# Altium schematic sheet Sheet1.SchDoc
size OrCAD A
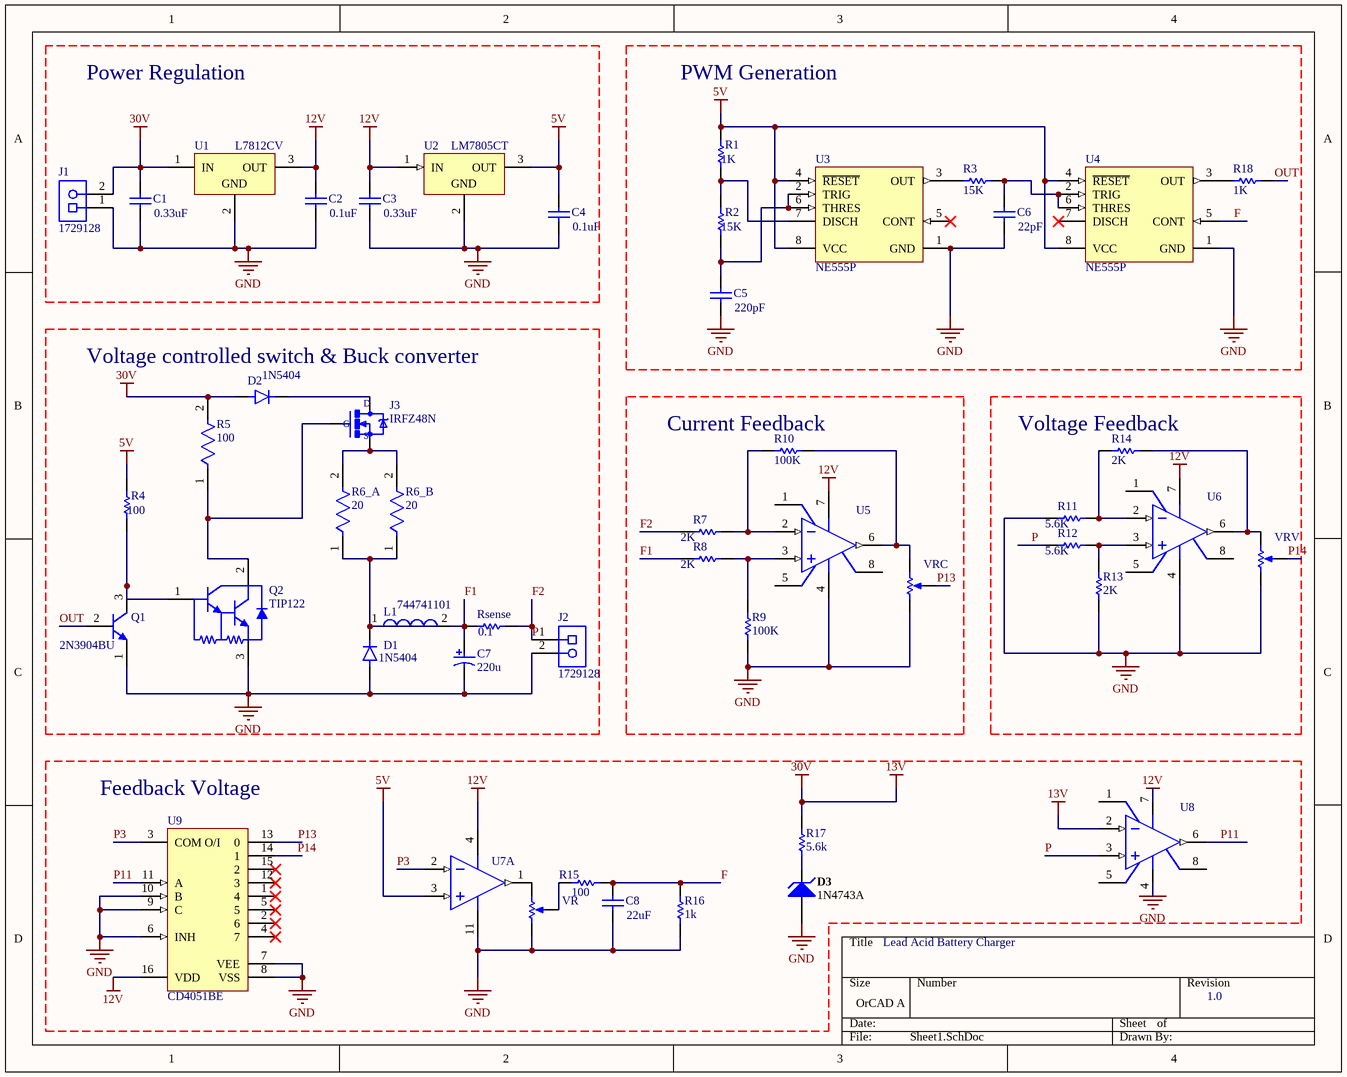
[diagram p0: Sheet1.SchDoc]

## Parts
C1  value 0.33uF  [RAD-0.3]  (hidden comment: Cap)
C2  value 0.1uF  [RAD-0.3]  (hidden comment: Cap)
C3  value 0.33uF  [RAD-0.3]  (hidden comment: Cap)
C4  value 0.1uF  [RAD-0.3]  (hidden comment: Cap)
C5  value 220pF  [RAD-0.3]  (hidden comment: Cap)
C6  value 22pF  [RAD-0.3]  (hidden comment: Cap)
C7  220u  [PNSC-ECA-1VM221-2]
C8  value 22uF  [RAD-0.3]  (hidden comment: Cap)
D1  1N5404  [DIOAD1990W125L900D530]
D2  1N5404  [DIOAD1990W125L900D530]
D3  1N4743A  [FAIR-DO-41-2_V]
J1  1729128  [PHOE-1729128-2_V]
J2  1729128  [PHOE-1729128-2_V]
J3  IRFZ48N  [TO-220]
L1  744741101  [WE-TI-LS]
Q1  2N3904BU  [FAIR-TO-92]
Q2  TIP122  [ONSC-TO-220-3-221A-09]
R1  value 1K  [AXIAL-0.3]  (hidden comment: Res1)
R2  value 15K  [AXIAL-0.3]  (hidden comment: Res1)
R3  value 15K  [AXIAL-0.3]  (hidden comment: Res1)
R4  value 100  [AXIAL-0.3]  (hidden comment: Res1)
R5  100  [FP-SQP500-MFG]
R6_A  20  [FP-SQP500-MFG]
R6_B  20  [FP-SQP500-MFG]
R7  value 2K  [AXIAL-0.3]  (hidden comment: Res1)
R8  value 2K  [AXIAL-0.3]  (hidden comment: Res1)
R9  value 100K  [AXIAL-0.3]  (hidden comment: Res1)
R10  value 100K  [AXIAL-0.3]  (hidden comment: Res1)
R11  value 5.6K  [AXIAL-0.3]  (hidden comment: Res1)
R12  value 5.6K  [AXIAL-0.3]  (hidden comment: Res1)
R13  value 2K  [AXIAL-0.3]  (hidden comment: Res1)
R14  value 2K  [AXIAL-0.3]  (hidden comment: Res1)
R15  value 100  [AXIAL-0.3]  (hidden comment: Res1)
R16  value 1k  [AXIAL-0.3]  (hidden comment: Res1)
R17  value 5.6k  [AXIAL-0.3]  (hidden comment: Res1)
R18  value 1K  [AXIAL-0.3]  (hidden comment: Res1)
Rsense  value 0.1  [AXIAL-0.3]  (hidden comment: Res1)
U1  L7812CV  [TO220]
U2  LM7805CT  [FAIR-TO-220-3]
U3  NE555P  [P0008A]
U4  NE555P  [P0008A]
U5  LM741CN/NOPB  [P0008A]  (value not drawn)
U6  LM741CN/NOPB  [P0008A]  (value not drawn)
U7  TL074ACN  [N0014A]  (value not drawn)  (part A of 4)
U8  LM741CN/NOPB  [P0008A]  (value not drawn)
U9  CD4051BE  [N0016A]
VR  3362P-1-103LF  [BOUR-3362P]  (value not drawn)
VRC  3362P-1-103LF  [BOUR-3362P]  (value not drawn)
VRV  3362P-1-103LF  [BOUR-3362P]  (value not drawn)

## Blocks framed on the sheet
Power Regulation: C1-C4 J1 U1 U2
PWM Generation: C5 C6 R1-R3 R18 U3 U4
Voltage controlled switch & Buck converter: C7 D1 D2 J2 J3 L1 Q1 Q2 R4 R5 R6_A R6_B Rsense
Current Feedback: R7-R10 U5 VRC
Voltage Feedback: R11-R14 U6 VRV
Feedback Voltage: C8 D3 R15-R17 U7-U9 VR

## Nets
5V: C4.2 R1.2 R4.2 U2.3(OUT) U3.4(~{RESET}) U3.8(VCC) U4.4(~{RESET}) U4.8(VCC) U7.3(IN1+)
12V: C2.2 C3.2 U1.3(OUT) U2.1(IN) U5.7(V+) U6.7(V+) U7.4(VCC+) U8.7(V+) U9.16(VDD)
13V: C1.2 D2.A J1.2 R5.2 R17.1 U1.1(IN) U8.2(IN-)  [also labelled 30V]
GND: C1.1 C2.1 C3.1 C4.1 C5.1 C6.1 C7.2 C8.1 D1.A D3.1(A) J1.1 J2.2 Q1.1(E) Q2.3(E) R9.1 R11.1 R13.1 R16.2 U1.2(GND) U2.2(GND) U3.1(GND) U4.1(GND) U5.4(V-) U6.4(V-) U7.11(VCC-) U8.4(V-) U9.6(INH) U9.7(VEE) U9.8(VSS) U9.9(C) U9.10(B) VR.1(CCW) VRC.1(CCW) VRV.1(CCW)
F: C8.2 R15.1 R16.1 U4.5(CONT)
F1: C7.1 L1.2 R8.1 Rsense.1
F2: J2.1 R7.1 R12.1 Rsense.2 U8.3(IN+)  [also labelled P]
OUT: Q1.2(B) R18.1
P3: U7.2(IN1-) U9.3(COM_O/I)
P11: U8.6(OUT) U9.11(A)
P13: U9.13(0) VRC.2(S)
P14: U9.14(1) VRV.2(S)
NetC5_2: C5.2 R2.1 U3.2(TRIG) U3.6(THRES)
NetC6_2: C6.2 R3.1 U4.2(TRIG) U4.6(THRES)
NetD1_C: D1.C(K) L1.1 R6_A.1 R6_B.1
NetD2_C: D2.C(K) J3.2(D)
NetD3_2: D3.2(K) R17.2
NetJ3_1: J3.1(G) Q2.2(C) R5.1
NetJ3_3: J3.3(S) R6_A.2 R6_B.2
NetQ1_3: Q1.3(C) Q2.1(B) R4.1
NetR1_1: R1.1 R2.2 U3.7(DISCH)
NetR3_2: R3.2 U3.3(OUT)
NetR7_2: R7.2 R10.2 U5.2(IN-)
NetR8_2: R8.2 R9.2 U5.3(IN+)
NetR10_1: R10.1 U5.6(OUT) VRC.3(CW)
NetR11_2: R11.2 R14.2 U6.2(IN-)
NetR12_2: R12.2 R13.2 U6.3(IN+)
NetR14_1: R14.1 U6.6(OUT) VRV.3(CW)
NetR15_2: R15.2 VR.2(S)
NetR18_2: R18.2 U4.3(OUT)
NetU7_1: U7.1(OUT1) VR.3(CW)

Not connected (* = marked no-connect by the designer): U3 5(CONT)*; U4 7(DISCH)*; U5 1(OFS_NULL) 5(OFS_NULL) 8(NC); U6 1(OFS_NULL) 5(OFS_NULL) 8(NC); U8 1(OFS_NULL) 5(OFS_NULL) 8(NC); U9 1(4)* 2(6)* 4(7)* 5* 12(3)* 15(2)*

## Notes on the sheet
- Lead Acid Battery Charger
- 1.0

## Library data of the parts
C1-C6 C8 = Cap: Capacitor; Published: 8-Jun-2000; LatestRevisionDate: 17-Jul-2002; LatestRevisionNote: Re-released for DXP Platform.; PackageReference: RAD-0.3; Publisher: Altium Limited; PackageDescription: Radial Cap, Thru-Hole; 2 Leads; 0.3 in Pin Spacing
C7 = CMP-2000-05311-1: Aluminum Electrolytic Capacitor, 220 uF, +/- 20%, 35 V, -40 to 85 degC, 2-Pin THD, RoHS, Bulk; Manufacturer: Panasonic; Lifetime@Temperature: 2000Hrs@85degC; Rated Voltage: 35V; Ripple Current: 350mA; Type: Radial; Capacitance: 220µF; Package Reference: ECA-1VM221; Series: M; Operating Temp Range: -40to+85degC; Package Description: 2-Pin Axial Lead, Dia 8 mm, Body Length 12.5 mm; Datasheet Version: Mar-06; Datasheet URL: https://datasheet.ciiva.com/26341/441851-da-01-en-elko-eca1vm221-m-r-220myf-35v-85c-26341906.pdf; Operating Temp-Max: 85degC; Case Size/Dimension: Ø8x11.5mm; Manufacturer URL: http://www.panasonic.com/
D1 D2 = 1N5404RL: MF: {'manufacturer': u'ON Semiconductor'}; Package: None; Price: None; MP: 1N5404RL; Availability: Unavailable; Value: *
D3 = CMP-0892-00006-1: Zener Diode, 13V, 1W, 5%, -65 to 200 degC, 2-Pin DO-41, Body 2.72 x 5.2 mm, RoHS; Manufacturer: Fairchild Semiconductor; VZ (Max.) (V): 13.65; ZZ (Max) (ohm): 9; IR (uA): 5; VZ (Min.) (V): 12.35; PD (W): 1; Test Current IZ (mA): 19; PartNumber: 1N4743A; Tolerance: 5%; ComponentLink2URL: http://www.fairchildsemi.com/ds/1N/1N4744A.pdf; ComponentLink3Description: Package Specification; ComponentLink2Description: Datasheet; ComponentLink1URL: http://www.fairchildsemi.com/; PackageReference: DO-41-2; PackageDescription: 2-Pin Axial leaded, Body 2.72 x 5.2 mm, Lead Spread 25.4 mm; Mounting Technology: Through Hole; PackageVersion: Rev. 2; ComponentLink3URL: http://www.fairchildsemi.com/dwg/DO/DO41A.pdf; Operating and Storage Temperature Range: -65 to 200 degC; DatasheetVersion: Rev. H3; RoHS: TRUE; ComponentLink1Description: Manufacturer URL
J1 J2 = CMP-2000-05815-1: PCB Terminal Block, 13.5 A, 400 V, 2-Pin THD, RoHS, Bulk; Manufacturer: Phoenix Contact; Package Version: 03/2015; No. of Rows: 1; Pitch: 5.08mm; No. of Positions: 2; Voltage Rating: 400V; Current Rating: 13500mA; Manufacturer URL: http://www.phoenixcontact.com/; Datasheet URL: https://datasheet.ciiva.com/16046/1729128-16046181.pdf; RoHS: TRUE; Package URL: https://www.phoenixcontact.com/online/portal/pi/pxc/product_detail_page/!ut/p/b1/3VdJjqNKFDxLH8AFycySyWY2ozFsEPOMMQaDOX1XedGL_1Vdm5YXJleknhSKeBkvI6EA8ncAo3AYoDhBQGco6KN7VURTdemj9us_IEKEZo_YHiPAEWEFmDGOHMORkqKYCORBZxgL7ZoaZYcbFFUZ3fqxSY6GOuxydWUuHqz1ynmMFygu583Bob0Ewr6Sd_l-5m-kAueHiB0jpRwZwe58wwtkpxtMYd_LmGcDRU02dRNEyWt6Y2ti5pSyJ_reIkzIulrqApdnbT11V5jnCKbYNCvhEM1MCpPByat_X379-iThf08CI5GfOPqfBeS3BRoBOdD55AKVv0iLwCMq-2BrzXWSGRH7pUGD9uwXQjiph3xL0DKQwdGa0JImiIOmBNOestqgwTHSSs2oOep-78apyXQBvNi8ZLaFjvjWvcaUEBu0MC6Wbe-d6mB0FAebo2lUWinqYaZs5DAYzV0RP9yitUjnGJ0iI9xhZkT42OCQNUJJhkgWINNQLP2JFP6OpMg3JCVg70jqHT0lvKOnhHf0lPuOnnLf0VPuWx6_dxwUIvwk5WMkT0kLL1mh61l2yZVSzG3pYV_bqo-mj6uMKwKwdnnW8Jh5RTOJzMOA5c-eJDaZQw4mTMPH02PvS_ZAqNVjVTo2WyYLkwH_KU1mmmG5kjRhDqPXLwwVHvVOjCM60-fpXvTDfMGW1PVFVS1r4e4yVDk4ZdNbkUHvqPqQSeian4UD39fNKmachqdJ1NJbyk8rXT9mXTvPk3oE5meulKGgiruPJek-4I9hTT6G8ZLOyRSm2RRVbThERQad5OS28hdt4YW4vG0stgYYzsWsK4_7y6DZMjJSCqri1kyiZR5vD7pwIrNR7QwPHTcLTI5qT7eRlpHrdGiupYlqQDJ7zy_CND8fWWBoLRXxk1RVcXiBQwbTD4Xi7KL-FuO94t9xaqweXzH; PartNumber: 1729128; Package Description: 2-Pin Through Hole Device, Body 8.1 x 10.16 mm, Pitch 5.08 mm; Datasheet Version: 12/2013; Mounting Technology: ThroughHole; Orientation: Horizontal; Package Reference: 1729128-2; Packing: Bulk
J3 = IRFZ44NPBF: MF: {'manufacturer': u'Infineon'}; Package: None; Availability: Unavailable; Value: *; MP: IRFZ44NPBF; Price: None
L1 = CMP-0225-00030-1: Radial Leaded Wire Wound Inductor WE-TI, L = 100 µH; Inductance: 100 ÂµH; ComponentLink2Description: Datasheet; ComponentLink2URL: http://www.we-online.de/katalog/media/pdf/744741101.pdf; PackageReference: WE-TI-LS; ComponentLink1URL: http://www.we-online.com; PackageDescription: THT Inductor, 2-Leads, Body 8.0 x 8.0 mm; ComponentLink1Description: Manufacturer Link; PackageVersion: 2004; DatasheetVersion: ver 2, Nov-2004
Q1 = CMP-2000-04944-1: NPN General-Purpose Amplifier, 40 V VCEO, 0.2 A, -55 to 150 degC, 2-Pin TO-92, RoHS, Bulk; Manufacturer: FairchildSemiconductor; Maximum Collector Base Voltage: 60V; Minimum DC Current Gain: 40@0.1mA@1V; Maximum Collector Emitter Voltage: 40V; Maximum DC Collector Current: 0.2A; Rad Hard: No; Maximum Operating Frequency: 300(Min)MHz; Maximum Collector Emitter Saturation Voltage: 0.2@1mA@10mA; Maximum Power Dissipation: 625mW; Package Description: 3-Pin Transistor Outline Package, Body Dia 4.79 mm, Pitch 1.27 mm; Package Reference: TO-92; Pin Count: 3; Operating Temperature: -55to150degC; Category: GPBJT; Manufacturer URL: https://www.fairchildsemi.com/; Datasheet URL: https://datasheet.ciiva.com/4722/2n3904-82270-4722369.pdf; Package: 3TO-92; Packaging: Bulk; Type: NPN; Datasheet Version: Rev. 1.1.0, 10/2014; Mounting: ThroughHole
Q2 = CMP-1047-00126-1: Plastic Medium-Power, Complementary Silicon Transistor, 3-Pin TO-220, Tube; Manufacturer: On Semiconductor; IC Continuous (A): 5; Polarity: NPN; PackageDescription: 3-Pin Flange Mount, Vertical Straight Lead, Body 9.97 x 4.445 mm, Pitch 2.54 mm; DatasheetVersion: Rev. 8; PartNumber: TIP122; ComponentLink1Description: Manufacturer URL; ComponentLink3Description: Package Specification; PackageReference: TO-220-3-221A-09; Mounting Technology: Through Hole; PackageVersion: Rev. AG, 09/2011; RoHS: FALSE; ComponentLink2Description: Datasheet; ComponentLink2URL: http://www.onsemi.cn/pub_link/Collateral/TIP120-D.PDF; ComponentLink3URL: http://www.onsemi.com/pub_link/Collateral/221A-09.PDF; ComponentLink1URL: http://www.onsemi.com/; Packing: Tube
R1-R4 R7-R18 Rsense = Res1: Resistor; Published: 8-Jun-2000; LatestRevisionDate: 17-Jul-2002; LatestRevisionNote: Re-released for DXP Platform.; PackageReference: AXIAL-0.3; Publisher: Altium Limited; PackageDescription: Axial Device, Thru-Hole; 2 Leads; 0.3 in Pin Spacing
R5 R6_A R6_B = CMP-03413-000003-1: RES 1.2 OHM 5W 5% AXIAL; Manufacturer Part Number: SQP500JB-1R2; Manufacturer: Yageo; Temperature Coefficient: 300ppm/°C; Resistance: 1.2Ω; Value: 1.2Ω; Voltage Rating: 350V; Lead Free: Yes; Package: SQP500; Composition: Wirewound; Series: SQP; Temperature: -55°C to +155°C; Device Class L2: Resistors; Digikey Description: RES 1.2 OHM 5W 5% AXIAL; RoHS: TRUE; Device Class L3: Through-Hole Resistors; ComponentLink2Description: Datasheet; ComponentLink2URL: https://datasheet.ciiva.com/2723/yageolr-sqpnsp-2013-2723111.pdf; Temperature Range High: +155°C; Octopart: https://octopart.com/sqp500jb-1r2-yageo-1162571; Device Class L1: Passive Components; Tolerance: 5%; Height: 10mm; Category: Res; Ipc Land Pattern Name: RESAD2911W100L2350D1050; Automotive: No; Power Rating: 5W; Temperature Range Low: -55°C
U1 = CMP-0244-00450-1: Positive Voltage Regulator, 12V, 3-Pin TO-220; PackageDescription: TO, Thru-Hole, Vertical, Heatsink Mounted; 3 In-Line Leads; Pitch 2.54 mm; ComponentLink3URL: http://www.st.com/internet/com/TECHNICAL_RESOURCES/TECHNICAL_LITERATURE/PACKAGE_INFORMATION/CD00004649.pdf; ComponentLink1URL: http://www.st.com; ComponentLink2Description: Datasheet; ComponentLink3Description: Package Specification; ComponentLink2URL: http://www.st.com/internet/com/TECHNICAL_RESOURCES/TECHNICAL_LITERATURE/DATASHEET/CD00000444.pdf; DatasheetVersion: 16/11/2011; PackageVersion: ver3.0; PackageReference: TO220; ComponentLink1Description: Manufacturer URL
U2 = CMP-2000-04938-1: Positive Voltage Regulator, 5 V, 1 A, -40 to 125 degC, 3-Pin TO-220, RoHS, Tube; Manufacturer: FairchildSemiconductor; Maximum Input Voltage: 35V; Maximum Quiescent Current: 8mA; Load Regulation: 100mV; Maximum Output Current: 2.2(Typ)A; Output Type: Fixed; Typical Dropout Voltage @ Current: 2@1AV; Rad Hard: No; Output Voltage: 5V; Accuracy: ±4%; Number of Outputs: 1; Category: LinearRegulator; Package Description: 3-Pin Through Hole Device, Body 10 x 4.5 mm, Pitch 2.54 mm; Packaging: Rail/Tube; Mounting: ThroughHole; Polarity: Positive; Manufacturer URL: https://www.fairchildsemi.com/; Line Regulation: 100mV; Datasheet Version: Aug-12; Datasheet URL: https://datasheet.ciiva.com/26904/lm7805ct-26904988.pdf; Package Reference: TO-220; Package URL: https://www.fairchildsemi.com/package-drawings/TO/TO220B03.pdf; Package: 3TO-220AB; Operating Temperature: -40to125degC; Type: Linear
U3 U4 = CMP-2000-04954-1: Precision Timer, 4.5 to 16 V, 0 to 70 degC, 8-Pin DIP, Pb-Free, Tube; Manufacturer: TexasInstruments; Maximum High Level Output Current: -200mA; Number of Internal Timers: 1; Operating Supply Voltage: 5; Maximum Low Level Output Current: 200mA; Rad Hard: No; Packaging: Rail/Tube; Manufacturer URL: http://www.ti.com/; Package Reference: P8; Package Description: 8-Pin Double In-line Package, Body 9.59 x 6.35 mm, Pitch 2.54 mm; Package URL: http://www.ti.com/lit/ml/mpdi001b/mpdi001b.pdf; Type: Standard; Datasheet URL: http://www.ti.com/general/docs/lit/getliterature.tsp?genericPartNumber=NE555&fileType=pdf; Category: Timer; Package: 8PDIP; Datasheet Version: Rev. I, 09/2014
U5 U6 U8 = CMP-0055-00162-3: Operational Amplifier, 8-pin MDIP, Pb-Free; Manufacturer: Texas Instruments; PackageTopMarking: NSUZXYTTE#*LM*741CN; PowerWise: N; CompType: Amplifiers; ComponentLink1Description: Datasheet URL; ComponentLink1URL: http://www.ti.com/general/docs/lit/getliterature.tsp?genericPartNumber=LM741&fileType=pdf; PackageDescription: MDIP, .365 x .250 x .130in, 8 Lead, .100in Pitch; RoHS: Y; PinCount: 8; Code_JEDEC: MS-001-BA; Package Reference: P0008A
U7 = CMP-0015-00134-2: Low-Noise JFET-Input Operational Amplifier, 7 to 36 V, 0 to 70 degC, 14-pin DIP (N14), Pb-Free (RoHS); Manufacturer: Texas Instruments; Slew Rate(Typ)(V/us): 13; IIB(Max)(pA): 200; CMRR(Min)(dB): 75; Vio (25C)(Max)(mV): 6; Total Supply Voltage(Min)(+5V is 5, +/-5V is 10): 7; Rating: Catalog; Vn at 1kHz(Typ)(nV/rtHz): 18; Iq per channel(Max)(mA): 2.5; Total Supply Voltage(Max)(+5V is 5, +/-5V is 10): 36; Number of Channels: 4; GBW(Typ)(MHz): 3; Sub Family: General Purpose Amplifier, High Supply Voltage Amplifier (>=30V); Mounting Technology: Through Hole; PartNumber: TL074ACN; ComponentLink2Description: Datasheet; Eco-Plan: Pb-Free (RoHS); Code_JEDEC: MS-001; Offset Drift(Typ)(uV/C): 18; PackageReference: N0014A; PackageVersion: 4040049/E, 12/2002; ComponentLink1URL: http://www.ti.com/; ComponentLink2URL: http://www.ti.com/lit/ds/symlink/tl074a.pdf; DatasheetVersion: SLOS080J; ComponentLink1Description: Manufacturer URL; PackageDescription: 14-Pin Plastic In-Line, Body 19.305 x 6.35 mm, Pitch 2.54 mm; ComponentLink3Description: Package Specification; ComponentLink3URL: http://www.ti.com/lit/ml/mpdi002c/mpdi002c.pdf
U9 = CMP-1575-00059-4: CMOS Single 8-Channel Analog Multiplexer/Demultiplexer with Logic-Level Conversion, N0016A, TUBE; Manufacturer: Texas Instruments; VCC(Max)(V): 18; ICC(Typ)(mA): 0.00008; Output Drive (IOL/IOH)(Max)(mA): 1; Bandwidth(Max)(MHz): 20; Rating: Military; VCC(Min)(V): 5; Configuration: 1 X 1：8 MUX; Crosstalk: Yes; Ron(Max)(Ohms): 240; Ron(Typ)(Ohms): 125; DatasheetVersion: SCHS047G; Output Type: CMOS; PackageVersion: http://www.ti.com/lit/ml/mpdi002c/mpdi002c.pdf; Operating Temperature Range(C): -55 to 125; Generic Part Number: CD4051B; PackageReference: N0016A; Code_JEDEC: MS-001
VR VRC VRV = CMP-1747-00004-1: Square Trimpot(R) Trimming Potentiometer, 10 KOhm, 300 V, -55 to 125 degC, 3-Pin THD, RoHS, Tube; Voltage Rating: 220 mV; Power Rating: 1 W; Tolerance: 1%; Resistance: 50 mohm; Case/Package: 1206; Length: 3.2 mm; RoHSCompliant: True; PackageDescription: 3-Pin Through Hole Device, Body 6.6 x 6.99 mm, Pitch 2.54 mm; ComponentLink2Description: Datasheet; REACH SVHC: No SVHC; Mount: Surface Mount; Height: 0.6 mm; Packaging: Tape and Reel; ComponentLink1URL: http://www.bourns.com/; Case Code (Imperial): 0612; Pins: 2; Case Code (Metric): 1632; ComponentLink2URL: http://www.bourns.com/docs/Product-Datasheets/3362.pdf; Min Operating Temperature: -25degC; ComponentLink1Description: Manufacturer URL; PackageReference: 3326P; Max Operating Temperature: 125degC; Width: 1.6 mm; Package Quantity: 5000; DatasheetVersion: May-16